# EAGLE schematic Teensy (EAGLE 9.4.2)

## Sheet 1 of 5
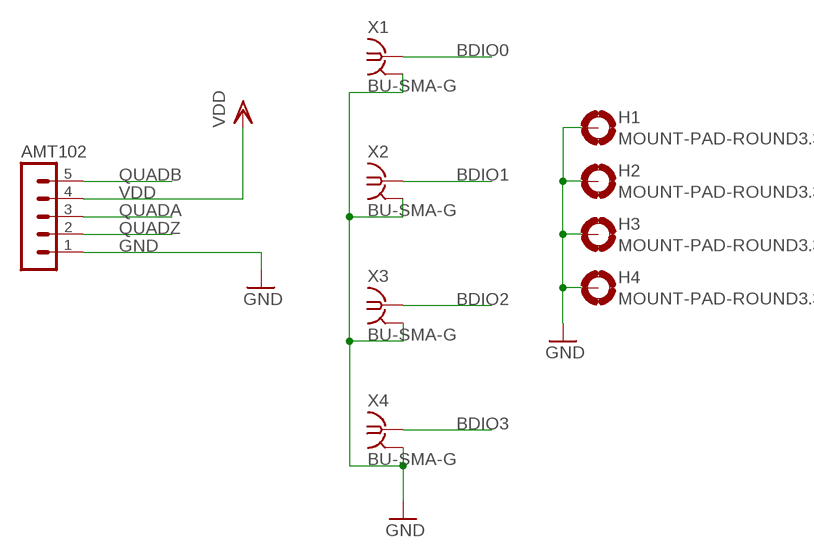
[diagram p0: schematic, sheet 1]

### Parts
AMT102  MA05-1  [MA05-1]
H1  MOUNT-PAD-ROUND3.3  [3,3-PAD]
H2  MOUNT-PAD-ROUND3.3  [3,3-PAD]
H3  MOUNT-PAD-ROUND3.3  [3,3-PAD]
H4  MOUNT-PAD-ROUND3.3  [3,3-PAD]
X1  BU-SMA-G  [BU-SMA-G]
X2  BU-SMA-G  [BU-SMA-G]
X3  BU-SMA-G  [BU-SMA-G]
X4  BU-SMA-G  [BU-SMA-G]

### Nets
BDIO0: X1.1 ; also sheet 5
BDIO1: X2.1 ; also sheet 5
BDIO2: X3.1 ; also sheet 5
BDIO3: X4.1 ; also sheet 5
GND: AMT102.1 H1.B3,3(MOUNT) H2.B3,3(MOUNT) H3.B3,3(MOUNT) H4.B3,3(MOUNT) X1.2 X1.3 X1.4 X1.5 X2.2 X2.3 X2.4 X2.5 X3.2 X3.3 X3.4 X3.5 X4.2 X4.3 X4.4 X4.5 ; also sheet 2,3,4,5
QUADA: AMT102.3 ; also sheet 5
QUADB: AMT102.5 ; also sheet 5
QUADZ: AMT102.2 ; also sheet 5
VDD: AMT102.4 ; also sheet 2,3,4,5

## Sheet 2 of 5
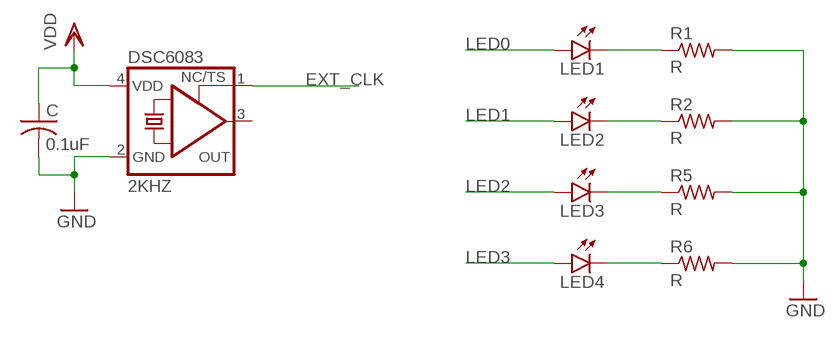
[diagram p1: schematic, sheet 2]

### Parts
C  0.1uF  C-USC0603  [C0603]
DSC6083  2KHZ  KXO-PXO/XO-V96  [3.2X2.5_KXO-V96]
LED1  LEDCHIPLED_0603  [CHIPLED_0603]
LED2  LEDCHIP-LED0603  [CHIP-LED0603]
LED3  LEDCHIP-LED0603  [CHIP-LED0603]
LED4  LEDCHIP-LED0603  [CHIP-LED0603]
R1  R  R-US_R0603  [R0603]
R2  R  R-US_R0603  [R0603]
R5  R  R-US_R0603  [R0603]
R6  R  R-US_R0603  [R0603]

### Nets
EXT_CLK: DSC6083.1(TS) ; also sheet 5
GND: C.2 DSC6083.2(GND) R1.2 R2.2 R5.2 R6.2 ; also sheet 1,3,4,5
LED0: LED1.A ; also sheet 5
LED1: LED2.A ; also sheet 5
LED2: LED3.A ; also sheet 5
LED3: LED4.A ; also sheet 5
N$1: LED1.C R1.1
N$2: LED2.C R2.1
N$5: LED3.C R5.1
N$6: LED4.C R6.1
VDD: C.1 DSC6083.4(VDD) ; also sheet 1,3,4,5
Unconnected: DSC6083.3(OUT)

## Sheet 3 of 5
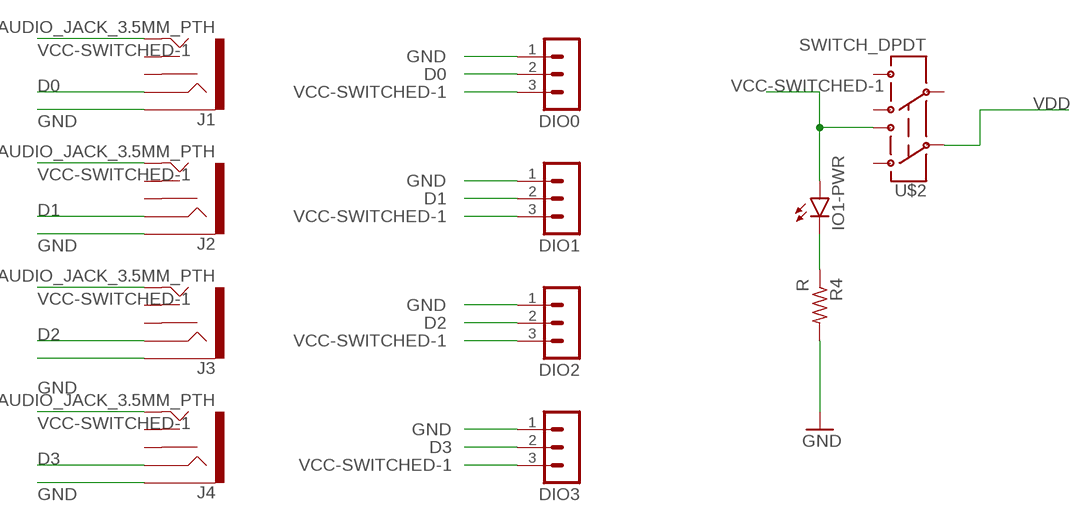
[diagram p2: schematic, sheet 3]

### Parts
DIO0  MA03-1  [MA03-1]
DIO1  MA03-1  [MA03-1]
DIO2  MA03-1  [MA03-1]
DIO3  MA03-1  [MA03-1]
IO1-PWR  LEDCHIP-LED0603  [CHIP-LED0603]
J1  AUDIO_JACK_3.5MM_PTH  [AUDIO-JACK]
J2  AUDIO_JACK_3.5MM_PTH  [AUDIO-JACK]
J3  AUDIO_JACK_3.5MM_PTH  [AUDIO-JACK]
J4  AUDIO_JACK_3.5MM_PTH  [AUDIO-JACK]
R4  R  R-US_R0603  [R0603]
U$2  SWITCH_DPDT  [JS_DPDT_TH]

### Nets
D0: DIO0.2 J1.RING ; also sheet 5
D1: DIO1.2 J2.RING ; also sheet 5
D2: DIO2.2 J3.RING ; also sheet 5
D3: DIO3.2 J4.RING ; also sheet 5
GND: DIO0.1 DIO1.1 DIO2.1 DIO3.1 J1.SLEEVE J2.SLEEVE J3.SLEEVE J4.SLEEVE R4.2 ; also sheet 1,2,4,5
N$4: IO1-PWR.C R4.1
VCC-SWITCHED-1: DIO0.3 DIO1.3 DIO2.3 DIO3.3 IO1-PWR.A J1.TIP J2.TIP J3.TIP J4.TIP U$2.3
VDD: U$2.2 ; also sheet 1,2,4,5
Unconnected: J1.RSH J1.TSH J2.RSH J2.TSH J3.RSH J3.TSH J4.RSH J4.TSH U$2.1 U$2.4 U$2.5 U$2.6

## Sheet 4 of 5
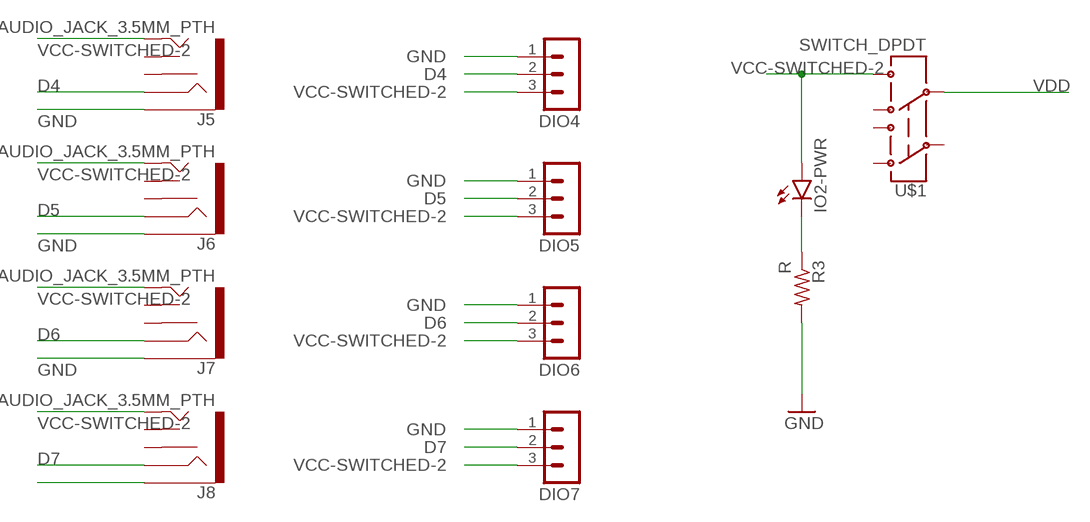
[diagram p3: schematic, sheet 4]

### Parts
DIO4  MA03-1  [MA03-1]
DIO5  MA03-1  [MA03-1]
DIO6  MA03-1  [MA03-1]
DIO7  MA03-1  [MA03-1]
IO2-PWR  LEDCHIP-LED0603  [CHIP-LED0603]
J5  AUDIO_JACK_3.5MM_PTH  [AUDIO-JACK]
J6  AUDIO_JACK_3.5MM_PTH  [AUDIO-JACK]
J7  AUDIO_JACK_3.5MM_PTH  [AUDIO-JACK]
J8  AUDIO_JACK_3.5MM_PTH  [AUDIO-JACK]
R3  R  R-US_R0603  [R0603]
U$1  SWITCH_DPDT  [JS_DPDT_TH]

### Nets
D4: DIO4.2 J5.RING ; also sheet 5
D5: DIO5.2 J6.RING ; also sheet 5
D6: DIO6.2 J7.RING ; also sheet 5
D7: DIO7.2 J8.RING ; also sheet 5
GND: DIO4.1 DIO5.1 DIO6.1 DIO7.1 J5.SLEEVE J6.SLEEVE J7.SLEEVE J8.SLEEVE R3.2 ; also sheet 1,2,3,5
N$3: IO2-PWR.C R3.1
VCC-SWITCHED-2: DIO4.3 DIO5.3 DIO6.3 DIO7.3 IO2-PWR.A J5.TIP J6.TIP J7.TIP J8.TIP U$1.6
VDD: U$1.5 ; also sheet 1,2,3,5
Unconnected: J5.RSH J5.TSH J6.RSH J6.TSH J7.RSH J7.TSH J8.RSH J8.TSH U$1.1 U$1.2 U$1.3 U$1.4

## Sheet 5 of 5
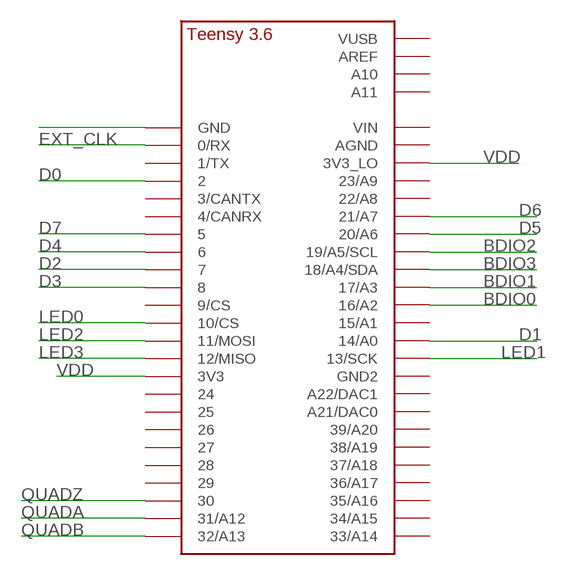
[diagram p4: schematic, sheet 5]

### Parts
U$3  TEENSY_3.5/3.6_BASIC  [TEENSY_3.5/3.6_BASIC]

### Nets
BDIO0: U$3.16/A2 ; also sheet 1
BDIO1: U$3.17/A3 ; also sheet 1
BDIO2: U$3.19/A5/SCL ; also sheet 1
BDIO3: U$3.18/A4/SDA ; also sheet 1
D0: U$3.2 ; also sheet 3
D1: U$3.14/A0 ; also sheet 3
D2: U$3.7 ; also sheet 3
D3: U$3.8 ; also sheet 3
D4: U$3.6 ; also sheet 4
D5: U$3.20/A6 ; also sheet 4
D6: U$3.21/A7 ; also sheet 4
D7: U$3.5 ; also sheet 4
EXT_CLK: U$3.0/RX ; also sheet 2
GND: U$3.GND ; also sheet 1,2,3,4
LED0: U$3.10/CS ; also sheet 2
LED1: U$3.13/SCK ; also sheet 2
LED2: U$3.11/MOSI ; also sheet 2
LED3: U$3.12/MISO ; also sheet 2
QUADA: U$3.31/A12 ; also sheet 1
QUADB: U$3.32/A13 ; also sheet 1
QUADZ: U$3.30 ; also sheet 1
VDD: U$3.3V3 U$3.3V3_LO ; also sheet 1,2,3,4
Unconnected: U$3.1/TX U$3.3/CANTX U$3.4/CANRX U$3.9/CS U$3.15/A1 U$3.21/DAC0(A21/DAC0) U$3.22/A8 U$3.23/A9 U$3.24 U$3.25 U$3.26 U$3.27 U$3.28 U$3.29 U$3.33/A14 U$3.34/A15 U$3.35/A16 U$3.36/A17 U$3.37/A18 U$3.38/A19 U$3.39/A20 U$3.A10 U$3.A11 U$3.A22/DAC1 U$3.AGND U$3.AREF U$3.GND2 U$3.VIN U$3.VUSB

## Library data of the parts
AMT102 = con-lstb-mod:MA05-1: PIN HEADER; OC_FARNELL: unknown; OC_NEWARK: unknown
C = rcl:C-US: CAPACITOR, American symbol; SPICEPREFIX: C
DIO0 DIO1-DIO7 = con-lstb:MA03-1: PIN HEADER; OC_FARNELL: unknown; OC_NEWARK: unknown
DSC6083 = crystal-geyer_V1_0:KXO-PXO/XO-V: Clock Oscillator (PXO/XO) MHz : KXO-V - Serie Model Size l/w/h [mm] Frequency Range Frequency Stability Temp. Range [°C] Output AECQ 200 availabel Datasheet KXO-V94 KXO-V94 KXO-V95 KXO-V95 KXO-V96 KXO-V96 KXO-V99 KXO-V99 KXO-97 KXO-V97 KXO-97 - KXO-V97 2.0/1.6/0.80 2.0/1.6/0.80 2.5/2.0/0.82 2.5/2.0/0.82 3.2/2.5/1.2 3.2/2.5/1.2 5.0/3.2/1.2 5.0/3.2/1.2 7.0/5.08/1.3 7.0/5.08/1.3 7.0/5.08/1.3 32,768 kHz 1,0 ~ 80,0 MHz 32,768 kHz 1,0 ~ 70,0 MHz 32,768 kHz 1,0 ~ 156,0 MHz 32,768 kHz 1,0 ~ 200,0 MHz 32,768 kHz 32,768 kHz 1,0 ~ 160,0 MHz ±25 … ±100ppm ±25 … ±100ppm ±25 … ±100ppm ±25 … ±100ppm ±25 … ±100ppm ±25 … ±100ppm ±25 … ±100ppm ±25 … ±100ppm ±25 … ±100ppm ±25 … ±100ppm ±25 … ±100ppm (*) -40°C …+85°C (*) -40°C …+85°C (*) -40°C …+85°C (*) -40°C …+85°C (*) -40°C …+85°C (*) -40°C …+85°C (*) -40°C …+85°C (*) -40°C …+85°C (*) -40°C …+85°C (*) -40°C …+85°C (*) -40°C …+85°C HCMOS HCMOS HCMOS HCMOS HCMOS HCMOS HCMOS HCMOS HCMOS HCMOS HCMOS - - yes yes yes yes - - - - - KXO-V94-kHz.pdf <http://www.geyer-electronic.de/uploads/tx_userartikelfrequenz/GEYER-KXO-V94-kHz.pdf> KXO-V94.pdf <http://www.geyer-electronic.de/uploads/tx_userartikelfrequenz/GEYER-KXO-V94.pdf> KXO-V95-kHz.pdf <http://www.geyer-electronic.de/uploads/tx_userartikelfrequenz/GEYER-KXO-V95-kHz.pdf> KXO-V95.pdf <http://www.geyer-electronic.de/uploads/tx_userartikelfrequenz/GEYER-KXO-V95.pdf> KXO-V96-kHz.pdf <http://www.geyer-electronic.de/uploads/tx_userartikelfrequenz/GEYER-KXO-V96-kHz.pdf> KXO-V96.pdf <http://www.geyer-electronic.de/uploads/tx_userartikelfrequenz/GEYER-KXO-V96.pdf> KXO-V99-kHz.pdf <http://www.geyer-electronic.de/uploads/tx_userartikelfrequenz/GEYER-KXO-V99-kHz.pdf> KXO-V99.pdf <http://www.geyer-electronic.de/uploads/tx_userartikelfrequenz/GEYER-KXO-V99.pdf> KXO-97-kHz.pdf <http://www.geyer-electronic.de/uploads/tx_userartikelfrequenz/GEYER-KXO-97-kHz.pdf> KXO-V97-kHz.pdf <http://www.geyer-electronic.de/uploads/tx_userartikelfrequenz/GEYER-KXO-V97-kHz.pdf> KXO-V97.pdf <http://www.geyer-electronic.de/uploads/tx_userartikelfrequenz/GEYER-KXO-V97.pdf> <http://www.geyer-electronic.de/fileadmin/template/img/logo-geyer-electronic.png> Details see: http://www.geyer-electronic.de/Frequenz-Produkte.9.0.html Created 2016-06-07, Hans Locher 2016 (C) Geyer Quartz Technology Hans Locher KXOV94,KXOV95;KXOV96;KXOV97;KXO97;2016;2520;3225;5032;70508;2,5x2,0;3,2x2,5;5,0x3,2;7,0x5,08;2.5x2.0;3.2x2.5;5.0x3.2;7.0x5.08;
H1-H4 = holes:MOUNT-PAD-ROUND: MOUNTING PAD, round
IO1-PWR IO2-PWR LED1-LED4 = led:LED: LED OSRAM: - CHIPLED LG R971, LG N971, LY N971, LG Q971, LY Q971, LO R971, LY R971 LH N974, LH R974 LS Q976, LO Q976, LY Q976 LO Q996 - Hyper CHIPLED LW Q18S LB Q993, LB Q99A, LB R99A - SideLED LS A670, LO A670, LY A670, LG A670, LP A670 LB A673, LV A673, LT A673, LW A673 LH A674 LY A675 LS A676, LA A676, LO A676, LY A676, LW A676 LS A679, LY A679, LG A679 - Hyper Micro SIDELED® LS Y876, LA Y876, LO Y876, LY Y876 LT Y87S - SmartLED LW L88C, LW L88S LB L89C, LB L89S, LG L890 LS L89K, LO L89K, LY L89K LS L896, LA L896, LO L896, LY L896 - TOPLED LS T670, LO T670, LY T670, LG T670, LP T670 LSG T670, LSP T670, LSY T670, LOP T670, LYG T670 LG T671, LOG T671, LSG T671 LB T673, LV T673, LT T673, LW T673 LH T674 LS T676, LA T676, LO T676, LY T676, LB T676, LH T676, LSB T676, LW T676 LB T67C, LV T67C, LT T67C, LS T67K, LO T67K, LY T67K, LW E67C LS E67B, LA E67B, LO E67B, LY E67B, LB E67C, LV E67C, LT E67C LW T67C LS T679, LY T679, LG T679 LS T770, LO T770, LY T770, LG T770, LP T770 LB T773, LV T773, LT T773, LW T773 LH T774 LS E675, LA E675, LY E675, LS T675 LS T776, LA T776, LO T776, LY T776, LB T776 LHGB T686 LT T68C, LB T68C - Hyper Mini TOPLED® LB M676 - Mini TOPLED Santana® LG M470 LS M47K, LO M47K, LY M47K Source: http://www.osram.convergy.de LUXEON: - LUMILED® LXK2-PW12-R00, LXK2-PW12-S00, LXK2-PW14-U00, LXK2-PW14-V00 LXK2-PM12-R00, LXK2-PM12-S00, LXK2-PM14-U00 LXK2-PE12-Q00, LXK2-PE12-R00, LXK2-PE12-S00, LXK2-PE14-T00, LXK2-PE14-U00 LXK2-PB12-K00, LXK2-PB12-L00, LXK2-PB12-M00, LXK2-PB14-N00, LXK2-PB14-P00, LXK2-PB14-Q00 LXK2-PR12-L00, LXK2-PR12-M00, LXK2-PR14-Q00, LXK2-PR14-R00 LXK2-PD12-Q00, LXK2-PD12-R00, LXK2-PD12-S00 LXK2-PH12-R00, LXK2-PH12-S00 LXK2-PL12-P00, LXK2-PL12-Q00, LXK2-PL12-R00 Source: www.luxeon.com KINGBRIGHT: KA-3528ASYC Source: www.kingbright.com
J1-J8 = SparkFun-Connectors:AUDIO_JACK_3.5MM: Audio Jack 3.5mm variants of PTH and SMT stereo audio jack with bypass switches. SparkFun Products: SparkFun SparkPunk Sound Kit <[https://www.sparkfun.com/products/11177]> - PTH MP3 Trigger <https://www.sparkfun.com/products/13720> -3.5mm SMD SparkFun PicoBoard <https://www.sparkfun.com/products/11888>- 2.5mm SMD; PROD_ID: CONN-08774; SF_ID: PRT-08032
R1-R6 = rcl:R-US_: RESISTOR, American symbol; SPICEPREFIX: R
U$1 U$2 = ELEC327:SWITCH_DPDT
U$3 = Teensy356:TEENSY_3.5/3.6_BASIC
X1-X4 = con-coax:BU-SMA-G: FEMALE SMA CONNECTOR Radiall distributor RS 193-9117; OC_FARNELL: unknown; OC_NEWARK: unknown

## Net classes
0 default: clearance 0.205 mm